# Altium schematic sheet BNO085_IMU.SchDoc: IMU
size A4; DrawnBy: M. Small & J. Wilson; SheetNumber: 9; SheetTotal: 10
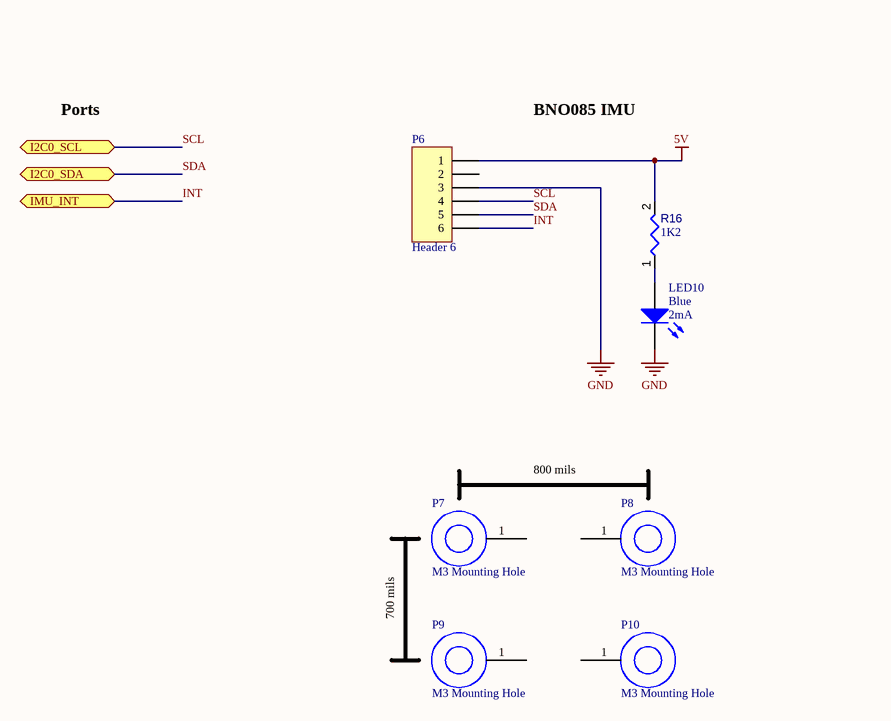
[diagram p0: BNO085_IMU.SchDoc]

## Parts
LED10  Blue  IF: 2mA  [1206_A]
P6  Header 6  [HDR1X6]
P7  M3 Mounting Hole  [M3 Mounting Hole]
P8  M3 Mounting Hole  [M3 Mounting Hole]
P9  M3 Mounting Hole  [M3 Mounting Hole]
P10  M3 Mounting Hole  [M3 Mounting Hole]
R16  1K2  [RESC0805(2012)_L]

## Ports
I2C0_SCL (bidir), I2C0_SDA (bidir), IMU_INT (bidir)

## Nets
5V: P6.1 R16.2
GND: LED10.1(K) P6.3
INT: P6.6 ; port IMU_INT
SCL: P6.4 ; port I2C0_SCL
SDA: P6.5 ; port I2C0_SDA
NetLED10_2: LED10.2(A) R16.1

Not connected (* = marked no-connect by the designer): P6 2; P7 1; P8 1; P9 1; P10 1

## Notes on the sheet
- Ports
- BNO085 IMU
- 800 mils
- 700 mils
- Date:
- Sheet
- of
- Time:
- Revision:
- Drawn by:
- File:

## Library data of the parts
LED10 = CMP-1426-00015-1: KPT-3216LVVBC-D -  LED, 3.2mm x 1.6mm, Blue, SMD, 2 mA, 2.65 V, 470 nm; Manufacturer: Kingbright; ComponentLink2Description: Datasheet; PartNumber: KPT-3216LVVBC-D; ComponentLink1Description: Manufacturer URL; ComponentLink2URL: http://www.farnell.com/datasheets/2068439.pdf; PackageReference: 1206_A; Color: Blue; Element14 Order Code: 2610425
P6 = Header 6: Header, 6-Pin; LatestRevisionDate: 17-Jul-2002; LatestRevisionNote: Re-released for DXP Platform.; Publisher: Altium Limited
P7-P10 = M3 Mounting Hole: M3 Mounting Hole, ID 2.73mm
R16 = CMP-009-00076-1: 1K2 0.125W 5% 0805 (2012 Metric)  SMD; Mounting Technology: SMT; Power: 0.125W; Value: 1K2; Pins: 2; Case/Package: 0805; Tolerance: 5%